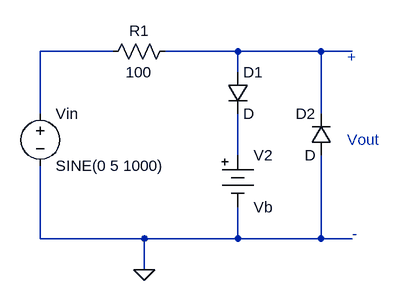
[diagram p0: schematic ClassicalClipperCircuit.asc]
ClassicalClipperCircuit.asc, the LTspice schematic file:
Version 4
SHEET 1 880 680
WIRE 368 240 256 240
WIRE 560 240 448 240
WIRE 688 240 560 240
WIRE 736 240 688 240
WIRE 560 272 560 240
WIRE 256 336 256 240
WIRE 688 336 688 240
WIRE 560 400 560 336
WIRE 256 528 256 416
WIRE 416 528 256 528
WIRE 560 528 560 480
WIRE 560 528 416 528
WIRE 688 528 688 400
WIRE 688 528 560 528
WIRE 736 528 688 528
WIRE 416 576 416 528
FLAG 416 576 0
SYMBOL voltage 256 320 R0
SYMATTR InstName Vin
SYMATTR Value SINE(0 5 1000)
SYMBOL res 464 224 R90
WINDOW 0 0 56 VBottom 2
WINDOW 3 32 56 VTop 2
SYMATTR InstName R1
SYMATTR Value 100
SYMBOL diode 544 272 R0
SYMATTR InstName D1
SYMBOL misc/battery 560 384 R0
SYMATTR InstName V2
SYMATTR Value Vb
SYMBOL diode 704 400 R180
WINDOW 0 24 64 Left 2
WINDOW 3 24 0 Left 2
SYMATTR InstName D2
TEXT 728 248 Left 2 ;+
TEXT 736 520 Left 2 ;-
TEXT 728 376 Left 2 ;Vout

The netlist it stands for:
* ClassicalClipperCircuit.asc
Vin N001 0 SINE(0 5 1000)
R1 N002 N001 100
D1 N002 N003 D
V2 N003 0 Vb
D2 0 N002 D
.model D D
.lib standard.dio
* +
* -
* Vout
.backanno
.end